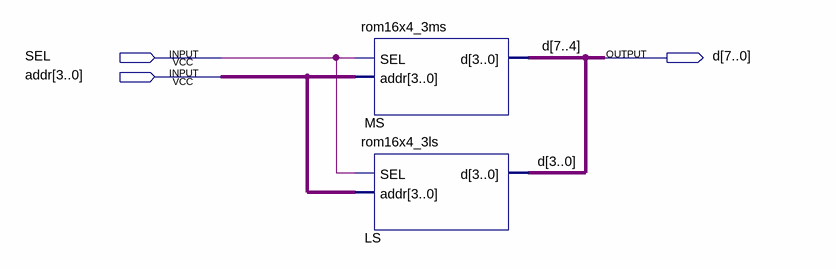
[diagram p0: schematic sheet]
// Quartus schematic rom16x8_3.bdf as structural Verilog: 2 symbols, 3 pins
module rom16x8_3 (
  input  SEL,
  input  [3:0] addr,
  output [7:0] d
);

  rom16x4_3ms MS (.SEL(SEL), .addr(addr), .d(d[7:4]));
  rom16x4_3ls LS (.SEL(SEL), .addr(addr), .d(d[3:0]));
endmodule
